# Altium schematic sheet LV+Schematic.schdoc
size 212 x 170 mm
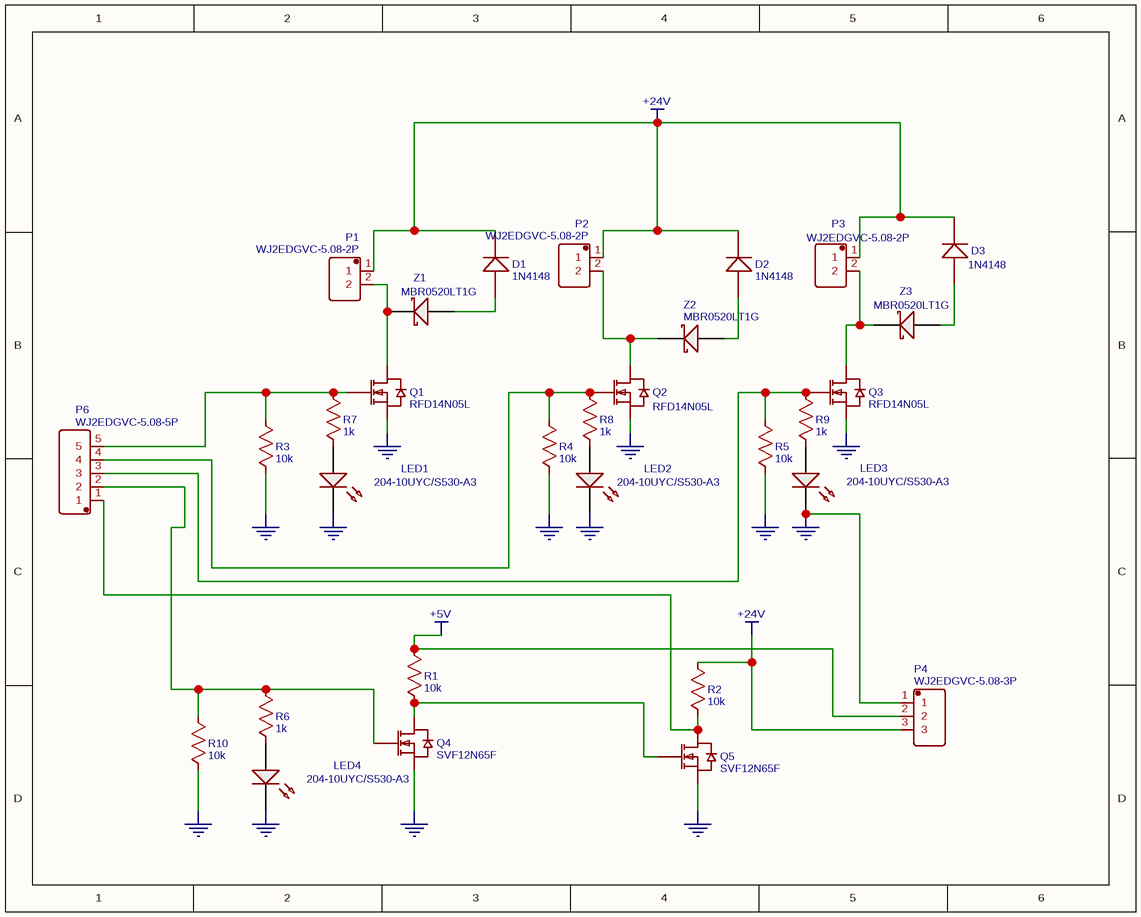
[diagram p0: LV+Schematic.schdoc]

## Parts
D1  value 1N4148  [DO-35]
D2  value 1N4148  [DO-35]
D3  value 1N4148  [DO-35]
LED1  value 204-10UYC/S530-A3  [LED-3MM/2.54]
LED2  value 204-10UYC/S530-A3  [LED-3MM/2.54]
LED3  value 204-10UYC/S530-A3  [LED-3MM/2.54]
LED4  value 204-10UYC/S530-A3  [LED-3MM/2.54]
P1  value WJ2EDGVC-5.08-2P  [WJ2EDGVC-5.08-2P]
P2  value WJ2EDGVC-5.08-2P  [WJ2EDGVC-5.08-2P]
P3  value WJ2EDGVC-5.08-2P  [WJ2EDGVC-5.08-2P]
P4  value WJ2EDGVC-5.08-3P  [WJ2EDGVC-5.08-3P]
P6  value WJ2EDGVC-5.08-5P  [WJ2EDGVC-5.08-5P]
Q1  value RFD14N05L  [TO-220(TO-220-3)]
Q2  value RFD14N05L  [TO-220(TO-220-3)]
Q3  value RFD14N05L  [TO-220(TO-220-3)]
Q4  value SVF12N65F  [TO-220(TO-220-3)]
Q5  value SVF12N65F  [TO-220(TO-220-3)]
R1  value 10k  [AXIAL-0.3]
R2  value 10k  [AXIAL-0.3]
R3  value 10k  [AXIAL-0.3]
R4  value 10k  [AXIAL-0.3]
R5  value 10k  [AXIAL-0.3]
R6  value 1k  [AXIAL-0.3]
R7  value 1k  [AXIAL-0.3]
R8  value 1k  [AXIAL-0.3]
R9  value 1k  [AXIAL-0.3]
R10  value 10k  [AXIAL-0.3]
Z1  value MBR0520LT1G  [DO-35]
Z2  value MBR0520LT1G  [DO-35]
Z3  value MBR0520LT1G  [DO-35]

## Nets
+5V: P4.2 R1.2
+24V: D1.2(K) D2.2(K) D3.2(K) P1.1 P2.1 P3.1 P4.3 R2.2
GND: LED1.2(C) LED2.2(C) LED3.2(C) LED4.2(C) P4.1 Q1.3(S) Q2.3(S) Q3.3(S) Q4.3(S) Q5.3(S) R3.1 R4.1 R5.1 R10.1
NetD1_1: D1.1(A) Z1.1(A)
NetD2_1: D2.1(A) Z2.1(A)
NetD3_1: D3.1(A) Z3.1(A)
NetLED1_1: LED1.1(A) R7.1
NetLED2_1: LED2.1(A) R8.1
NetLED3_1: LED3.1(A) R9.1
NetLED4_1: LED4.1(A) R6.1
NetP1_2: P1.2 Q1.2(D) Z1.2(K)
NetP2_2: P2.2 Q2.2(D) Z2.2(K)
NetP3_2: P3.2 Q3.2(D) Z3.2(K)
NetP6_1: P6.1 Q5.2(D) R2.1
NetP6_2: P6.2 Q4.1(G) R6.2 R10.2
NetP6_3: P6.3 Q3.1(G) R5.2 R9.2
NetP6_4: P6.4 Q2.1(G) R4.2 R8.2
NetP6_5: P6.5 Q1.1(G) R3.2 R7.2
NetQ4_2: Q4.2(D) Q5.1(G) R1.1

## Library data of the parts
D1-D3 = (no symbol name): BOM_Manufacturer: ST; BOM_LCSC: C14516; BOM_Supplier: LCSC; BOM_Manufacturer Part: 1N4148; spicePre: D
LED1-LED4 = (no symbol name): BOM_Manufacturer: EVERLIGHT; BOM_LCSC: C73643; BOM_Supplier: LCSC; BOM_Manufacturer Part: 204-10UYC/S530-A3; spicePre: L
Q1-Q3 = (no symbol name): BOM_Manufacturer: SILAN; BOM_Manufacturer Part: SVF12N65F; BOM_Supplier: LCSC; BOM_LCSC: C18781; spicePre: Q
Q4 Q5 = (no symbol name): BOM_Manufacturer: SILAN; BOM_Supplier: LCSC; BOM_Manufacturer Part: SVF12N65F; BOM_LCSC: C18781; spicePre: Q
R1-R10 = (no symbol name): nameAlias: Value(Ω); BOM_Manufacturer Part: ?; spicePre: R; spiceSymbolName: Resistor
Z1-Z3 = (no symbol name): BOM_Manufacturer: ON; BOM_LCSC: C23848; BOM_Supplier: LCSC; BOM_Manufacturer Part: MBR0520LT1G; spicePre: D
P1-P4 P6 = (no symbol name): spicePre: X; BOM_Supplier: LCSC; BOM_Manufacturer Part: ?
  P1-P3: BOM_LCSC: C8445
  P4: BOM_LCSC: C8430
  P6: BOM_LCSC: C8423